# EAGLE design eib-generic (EAGLE 6.5.0)
DESIGNER: JPN@MIT; DESIGN_NAME: 2x64_hirose-circular; LICENSE: (c) Jon Newman CC-BY-SA-NC 4.0; REVISION: 1.0
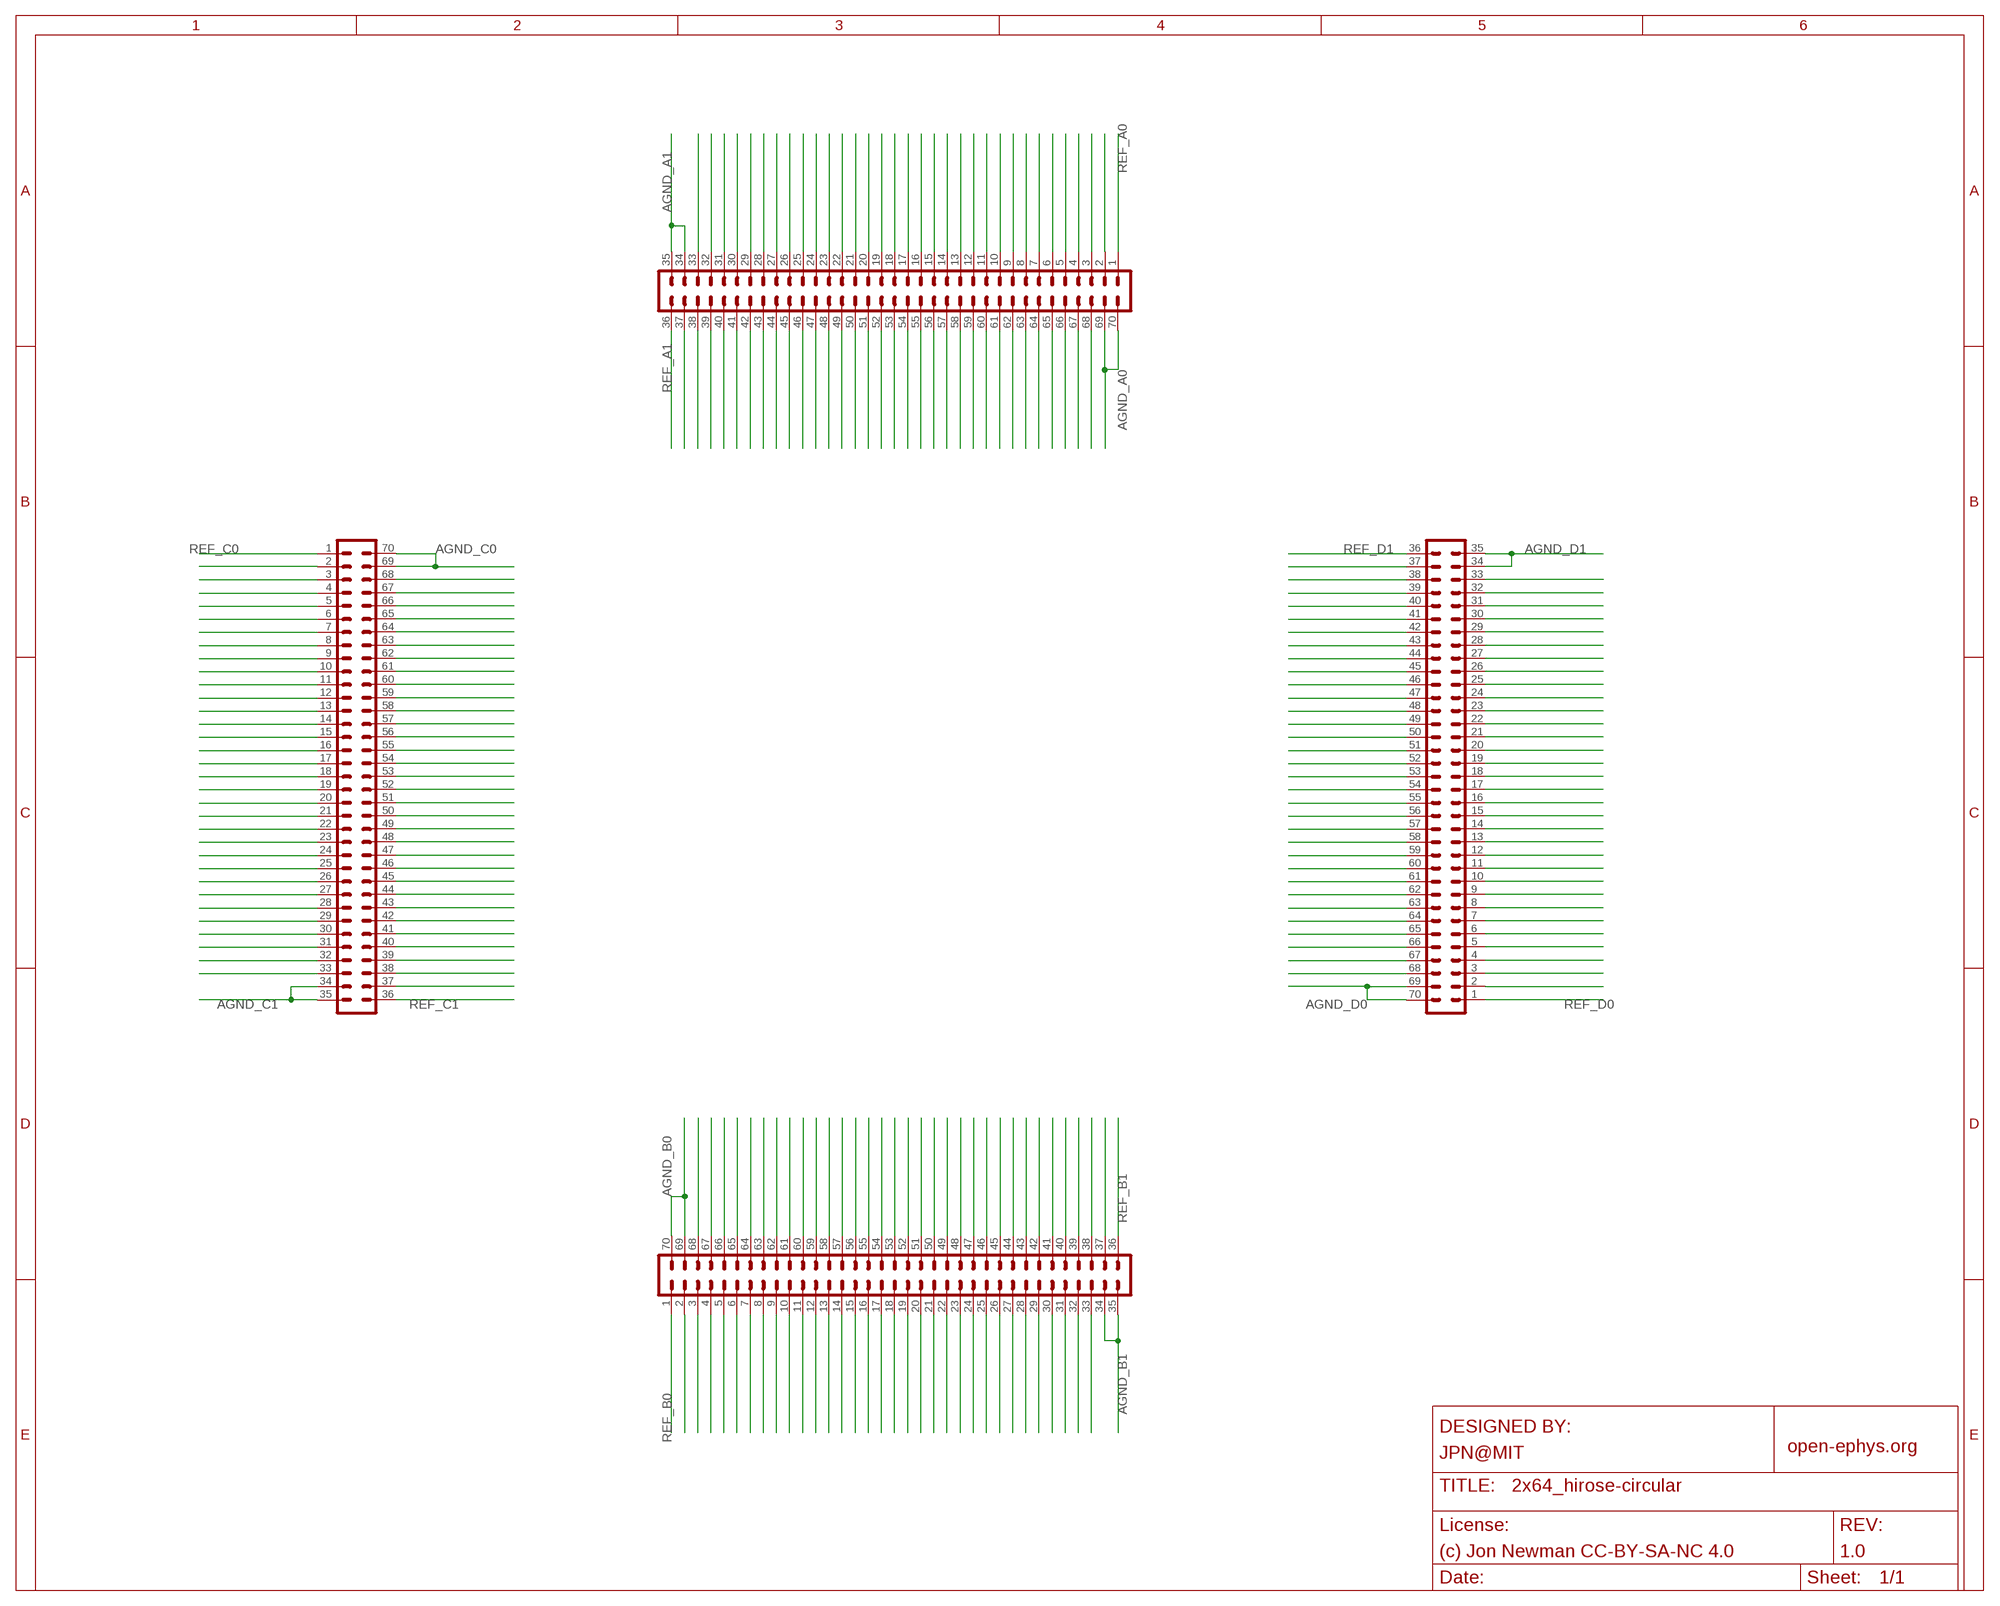
[diagram p0: schematic, sheet 1]

## Parts
A  DF40HEAD  PINHD-2X35_DF40HEAD  [DF40-70HEAD]
B  DF40HEAD  PINHD-2X35_DF40HEAD  [DF40-70HEAD]
C  DF40HEAD  PINHD-2X35_DF40HEAD  [DF40-70HEAD]
D  DF40HEAD  PINHD-2X35_DF40HEAD  [DF40-70HEAD]

## Nets
AGND_A0: A.69 A.70
AGND_A1: A.34 A.35
AGND_B0: B.69 B.70
AGND_B1: B.34 B.35
AGND_C0: C.69 C.70
AGND_C1: C.34 C.35
AGND_D0: D.69 D.70
AGND_D1: D.34 D.35
N$1: D.33
N$2: D.32
N$3: D.31
N$4: D.30
N$5: D.29
N$6: D.28
N$7: D.27
N$8: D.26
N$9: D.25
N$10: D.24
N$11: D.23
N$12: D.22
N$13: D.21
N$14: D.20
N$15: D.19
N$16: D.18
N$17: D.17
N$18: D.16
N$19: D.15
N$20: D.14
N$21: D.13
N$22: D.12
N$23: D.11
N$24: D.10
N$25: D.9
N$26: D.8
N$27: D.7
N$28: D.6
N$29: D.5
N$30: D.4
N$31: D.3
N$32: D.38
N$33: D.39
N$34: D.40
N$35: D.41
N$36: D.42
N$37: D.43
N$38: D.44
N$39: D.45
N$40: D.46
N$41: D.47
N$42: D.48
N$43: D.49
N$44: D.50
N$45: D.51
N$46: D.52
N$47: D.53
N$48: D.54
N$49: D.55
N$50: D.56
N$51: D.57
N$52: D.58
N$53: D.59
N$54: D.60
N$55: D.61
N$56: D.62
N$57: D.63
N$58: D.64
N$59: D.65
N$60: D.66
N$61: D.67
N$62: D.68
N$63: D.2
N$64: D.37
N$65: B.33
N$66: B.32
N$67: B.31
N$68: B.30
N$69: B.29
N$70: B.28
N$71: B.27
N$72: B.26
N$73: B.25
N$74: B.24
N$75: B.23
N$76: B.22
N$77: B.21
N$78: B.20
N$79: B.19
N$80: B.18
N$81: B.17
N$82: B.16
N$83: B.15
N$84: B.14
N$85: B.13
N$86: B.12
N$87: B.11
N$88: B.10
N$89: B.9
N$90: B.8
N$91: B.7
N$92: B.6
N$93: B.5
N$94: B.4
N$95: B.3
N$96: B.38
N$97: B.39
N$98: B.40
N$99: B.41
N$100: B.42
N$101: B.43
N$102: B.44
N$103: B.45
N$104: B.46
N$105: B.47
N$106: B.48
N$107: B.49
N$108: B.50
N$109: B.51
N$110: B.52
N$111: B.53
N$112: B.54
N$113: B.55
N$114: B.56
N$115: B.57
N$116: B.58
N$117: B.59
N$118: B.60
N$119: B.61
N$120: B.62
N$121: B.63
N$122: B.64
N$123: B.65
N$124: B.66
N$125: B.67
N$126: B.68
N$127: B.2
N$128: B.37
N$129: C.33
N$130: C.32
N$131: C.31
N$132: C.30
N$133: C.29
N$134: C.28
N$135: C.27
N$136: C.26
N$137: C.25
N$138: C.24
N$139: C.23
N$140: C.22
N$141: C.21
N$142: C.20
N$143: C.19
N$144: C.18
N$145: C.17
N$146: C.16
N$147: C.15
N$148: C.14
N$149: C.13
N$150: C.12
N$151: C.11
N$152: C.10
N$153: C.9
N$154: C.8
N$155: C.7
N$156: C.6
N$157: C.5
N$158: C.4
N$159: C.3
N$160: C.38
N$161: C.39
N$162: C.40
N$163: C.41
N$164: C.42
N$165: C.43
N$166: C.44
N$167: C.45
N$168: C.46
N$169: C.47
N$170: C.48
N$171: C.49
N$172: C.50
N$173: C.51
N$174: C.52
N$175: C.53
N$176: C.54
N$177: C.55
N$178: C.56
N$179: C.57
N$180: C.58
N$181: C.59
N$182: C.60
N$183: C.61
N$184: C.62
N$185: C.63
N$186: C.64
N$187: C.65
N$188: C.66
N$189: C.67
N$190: C.68
N$191: C.2
N$192: C.37
N$199: A.33
N$200: A.32
N$201: A.31
N$202: A.30
N$203: A.29
N$204: A.28
N$205: A.27
N$206: A.26
N$207: A.25
N$208: A.24
N$209: A.23
N$210: A.22
N$211: A.21
N$212: A.20
N$213: A.19
N$214: A.18
N$215: A.17
N$216: A.16
N$217: A.15
N$218: A.14
N$219: A.13
N$220: A.12
N$221: A.11
N$222: A.10
N$223: A.9
N$224: A.8
N$225: A.7
N$226: A.6
N$227: A.5
N$228: A.4
N$229: A.3
N$230: A.2
N$231: A.38
N$232: A.39
N$233: A.40
N$234: A.41
N$235: A.42
N$236: A.43
N$237: A.44
N$238: A.45
N$239: A.46
N$240: A.47
N$241: A.48
N$242: A.49
N$243: A.50
N$244: A.51
N$245: A.52
N$246: A.53
N$247: A.54
N$248: A.55
N$249: A.56
N$250: A.57
N$251: A.58
N$252: A.59
N$253: A.60
N$254: A.61
N$255: A.62
N$256: A.63
N$257: A.64
N$258: A.65
N$259: A.66
N$260: A.67
N$261: A.68
N$1000: A.37
REF_A0: A.1
REF_A1: A.36
REF_B0: B.1
REF_B1: B.36
REF_C0: C.1
REF_C1: C.36
REF_D0: D.1
REF_D1: D.36

## Library data of the parts
A B C D = jonnew:PINHD-2X35

## Net classes
1 thick: width 0.102 mm

## Board
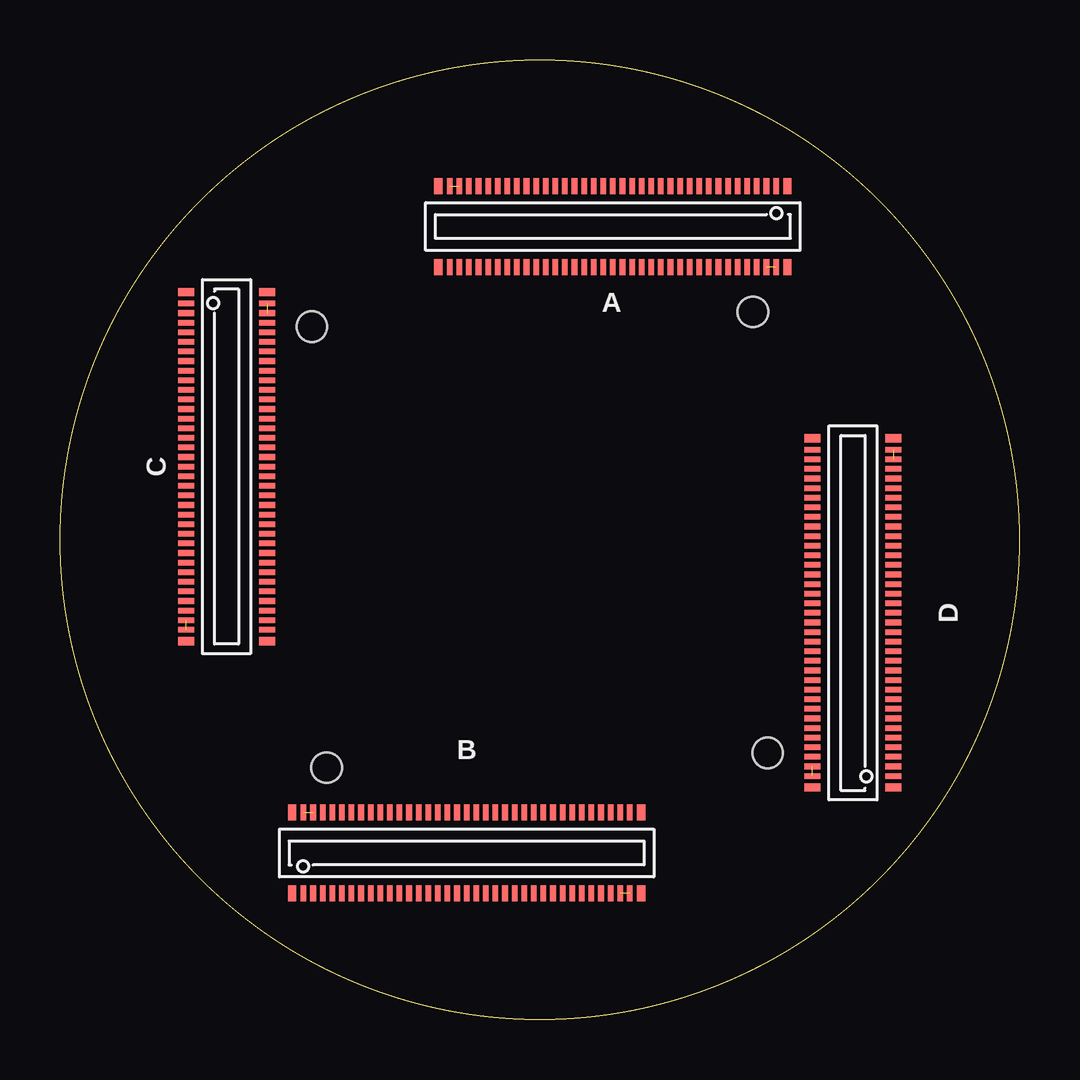
[diagram p1: board, top side]
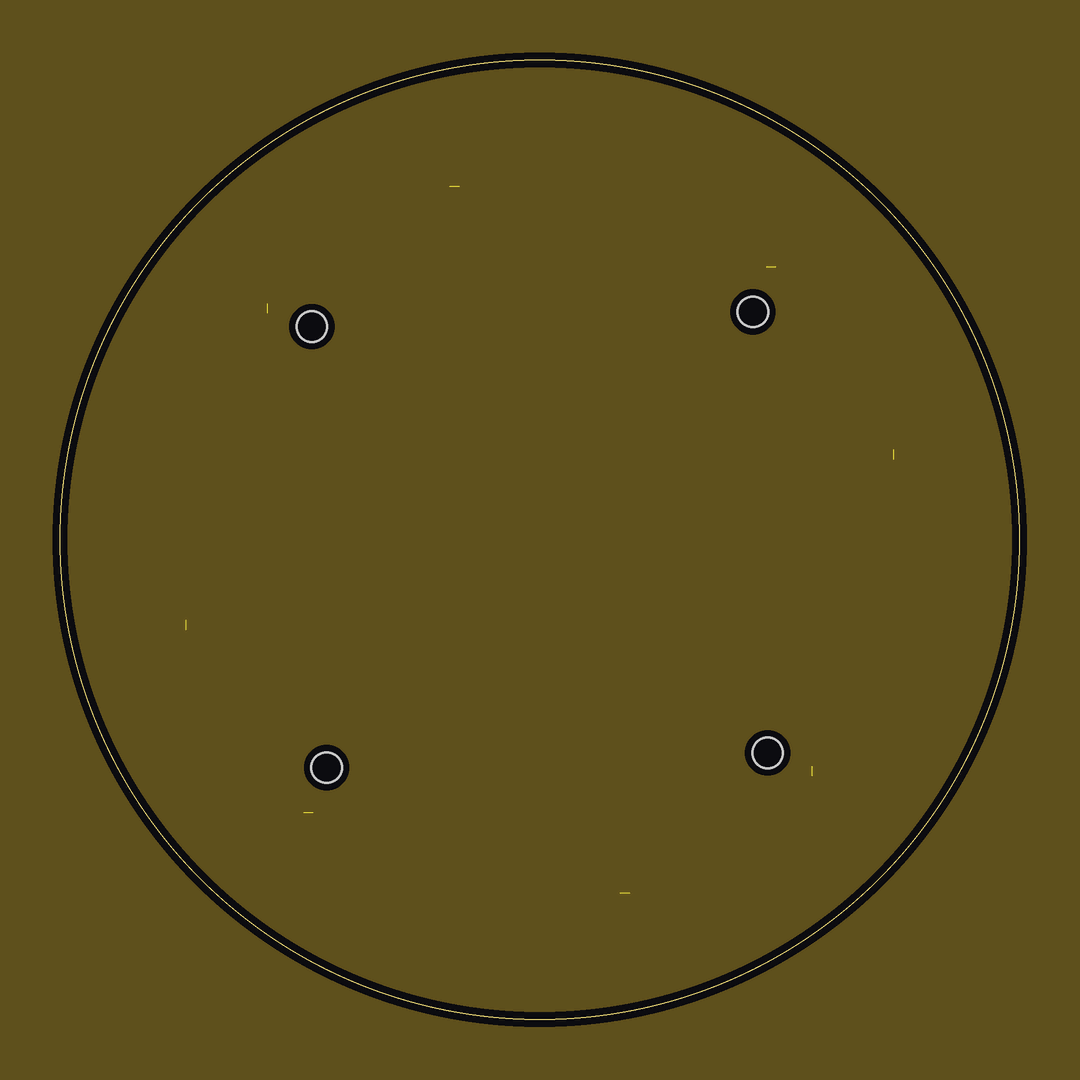
[diagram p2: board, inner layer Route2]
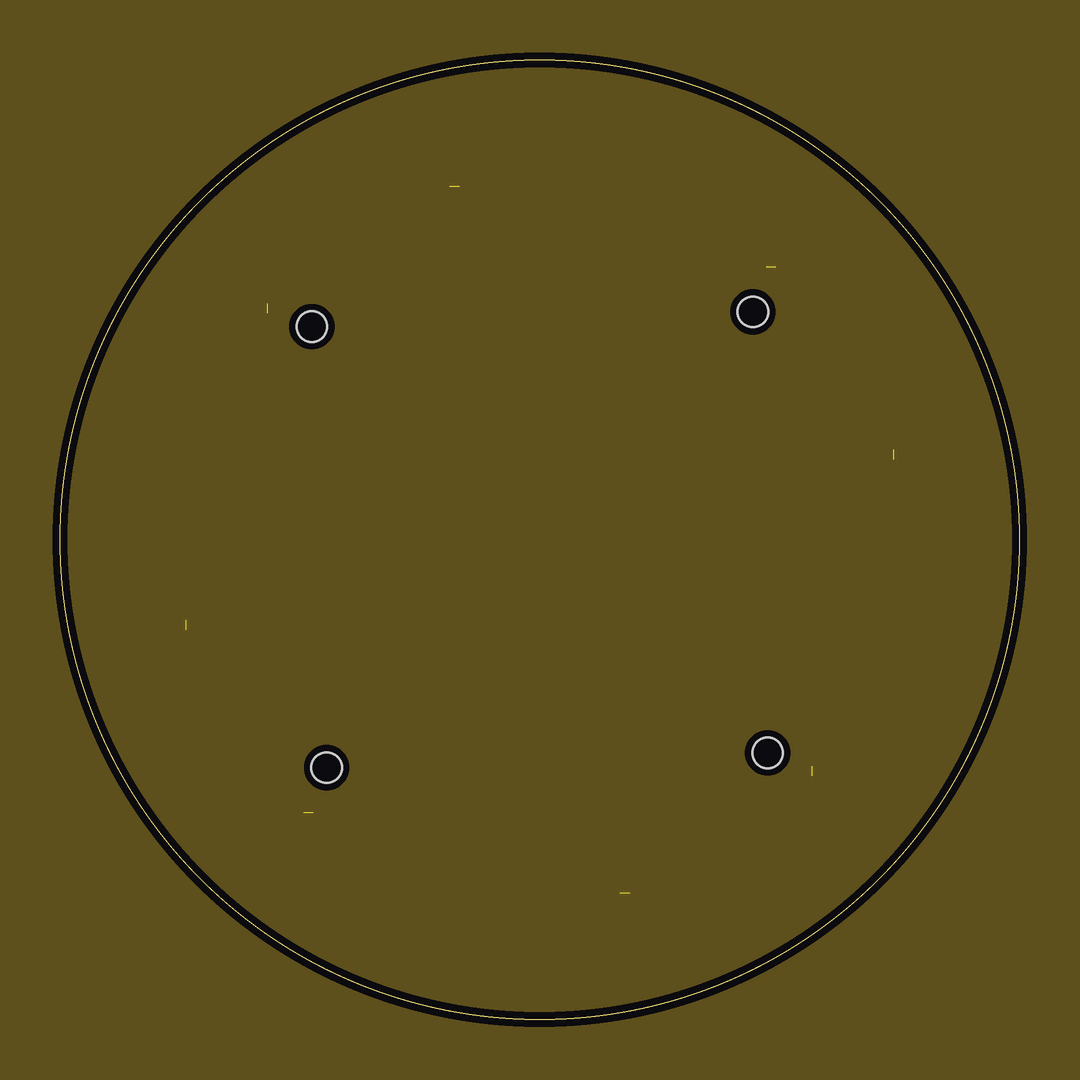
[diagram p3: board, inner layer Route3]

Size 40 x 40 mm. Coordinates in mm from the lower left corner, seen from the top.
Outline: circle at 20,20 radius 20
Copper layers (1*2+3*16): Top 0.035mm / dielectric 1.5mm / Route2 0.035mm / dielectric 0.15mm / Route3 0.035mm / dielectric 0.2mm / Bottom 0.035mm
Design rules "Precision-Image *": minimum track width 2mil, minimum drill 6mil, track to track 2mil, track to pad 2mil, pad to pad 2mil, via to via 2mil, smd to smd 2mil, copper to edge 12mil, drill to drill 15mil, minimum pad ring 5mil, minimum via ring 5mil, stop-mask expansion 2mil, vias tented up to drill 0mil, thermal gap 10mil
Holes 1.27 mm at 28.89,29.5 29.5,11.11 11.11,10.5 10.5,28.89

### Footprints (pad centres in the part's own frame; a part is rotated, then mirrored left to right if it is on the bottom)
DF40-70HEAD = smd 0.23 x 0.66: 1 -6.8,-1.685; 2 -6.4,-1.685; 3 -6,-1.685; 4 -5.6,-1.685; 5 -5.2,-1.685; 6 -4.8,-1.685; 7 -4.4,-1.685; 8 -4,-1.685; 9 -3.6,-1.685; 10 -3.2,-1.685; 11 -2.8,-1.685; 12 -2.4,-1.685; 13 -2,-1.685; 14 -1.6,-1.685; 15 -1.2,-1.685; 16 -0.8,-1.685; 17 -0.4,-1.685; 18 0,-1.685; 19 0.4,-1.685; 20 0.8,-1.685; 21 1.2,-1.685; 22 1.6,-1.685; 23 2,-1.685; 24 2.4,-1.685; 25 2.8,-1.685; 26 3.2,-1.685; 27 3.6,-1.685; 28 4,-1.685; 29 4.4,-1.685; 30 4.8,-1.685; 31 5.2,-1.685; 32 5.6,-1.685; 33 6,-1.685; 34 6.4,-1.685; 35 6.8,-1.685; 36 6.8,1.685; 37 6.4,1.685; 38 6,1.685; 39 5.6,1.685; 40 5.2,1.685; 41 4.8,1.685; 42 4.4,1.685; 43 4,1.685; 44 3.6,1.685; 45 3.2,1.685; 46 2.8,1.685; 47 2.4,1.685; 48 2,1.685; 49 1.6,1.685; 50 1.2,1.685; 51 0.8,1.685; 52 0.4,1.685; 53 0,1.685; 54 -0.4,1.685; 55 -0.8,1.685; 56 -1.2,1.685; 57 -1.6,1.685; 58 -2,1.685; 59 -2.4,1.685; 60 -2.8,1.685; 61 -3.2,1.685; 62 -3.6,1.685; 63 -4,1.685; 64 -4.4,1.685; 65 -4.8,1.685; 66 -5.2,1.685; 67 -5.6,1.685; 68 -6,1.685; 69 -6.4,1.685; 70 -6.8,1.685 | smd 0.35 x 0.66: M1 -7.275,-1.685; M2 7.275,-1.685; M3 7.275,1.685; M4 -7.275,1.685

### Placement (x,y rotation side)
A  23.05,33.06 180 top
B  16.95,6.94 0 top
C  6.94,23.05 270 top
D  33.06,16.95 90 top

### Tracks (layer width: path | path; a pad name or v marks a point on that pad's centre or on a via)
AGND_A0  (1 unrouted)
AGND_A1  (1 unrouted)
AGND_B0  (1 unrouted)
AGND_B1  (1 unrouted)
AGND_C0  (1 unrouted)
AGND_C1  (1 unrouted)
AGND_D0  (1 unrouted)
AGND_D1  (1 unrouted)
GND
  pour Route2 (no thermals): -2.86,42.86 42.86,42.86 42.86,-2.86 -2.86,-2.86
VCC
  pour Route3 (no thermals): -2.86,42.86 42.86,42.86 42.86,-2.86 -2.86,-2.86